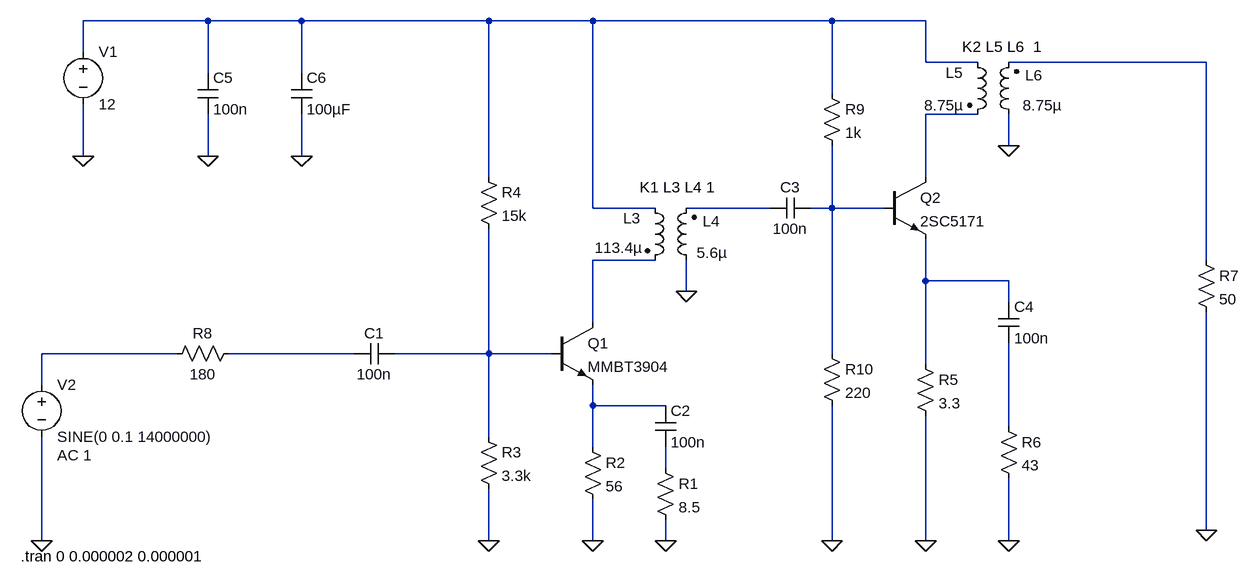
[diagram p0: schematic Driver Amplifier.asc]
Driver Amplifier.asc, the LTspice schematic file:
Version 4
SHEET 1 3796 680
WIRE -400 -352 -592 -352
WIRE -256 -352 -400 -352
WIRE 32 -352 -256 -352
WIRE 192 -352 32 -352
WIRE 560 -352 192 -352
WIRE 704 -352 560 -352
WIRE -592 -304 -592 -352
WIRE 704 -288 704 -352
WIRE 784 -288 704 -288
WIRE 1136 -288 832 -288
WIRE -400 -272 -400 -352
WIRE -256 -272 -256 -352
WIRE 560 -240 560 -352
WIRE 784 -208 704 -208
WIRE 832 -160 832 -208
WIRE -592 -144 -592 -224
WIRE -400 -144 -400 -208
WIRE -256 -144 -256 -208
WIRE 32 -112 32 -352
WIRE 704 -112 704 -208
WIRE 192 -64 192 -352
WIRE 288 -64 192 -64
WIRE 464 -64 336 -64
WIRE 560 -64 560 -160
WIRE 560 -64 528 -64
WIRE 640 -64 560 -64
WIRE 288 16 192 16
WIRE 1136 16 1136 -288
WIRE 704 48 704 -16
WIRE 832 48 704 48
WIRE 336 64 336 16
WIRE 832 80 832 48
WIRE 192 112 192 16
WIRE -448 160 -656 160
WIRE -176 160 -368 160
WIRE 32 160 32 -32
WIRE 32 160 -112 160
WIRE 128 160 32 160
WIRE 560 160 560 -64
WIRE 704 176 704 48
WIRE -656 208 -656 160
WIRE 192 240 192 208
WIRE 304 240 192 240
WIRE 832 272 832 144
WIRE 32 288 32 160
WIRE 192 304 192 240
WIRE 304 336 304 304
WIRE 1136 432 1136 96
WIRE -656 448 -656 288
WIRE 32 448 32 368
WIRE 192 448 192 384
WIRE 304 448 304 416
WIRE 560 448 560 240
WIRE 704 448 704 256
WIRE 832 448 832 352
FLAG -656 448 0
FLAG 304 448 0
FLAG 192 448 0
FLAG 32 448 0
FLAG 336 64 0
FLAG 832 -160 0
FLAG 704 448 0
FLAG 832 448 0
FLAG 1136 432 0
FLAG -592 -144 0
FLAG -400 -144 0
FLAG -256 -144 0
FLAG 560 448 0
SYMBOL npn 128 112 R0
SYMATTR InstName Q1
SYMATTR Value MMBT3904
SYMBOL npn 640 -112 R0
SYMATTR InstName Q2
SYMATTR Value 2SC5171
SYMBOL voltage -592 -320 R0
WINDOW 123 0 0 Left 2
WINDOW 39 0 0 Left 2
SYMATTR InstName V1
SYMATTR Value 12
SYMBOL voltage -656 192 R0
WINDOW 123 24 124 Left 2
WINDOW 39 0 0 Left 2
SYMATTR Value2 AC 1
SYMATTR InstName V2
SYMATTR Value SINE(0 0.1 14000000)
SYMBOL cap -112 144 R90
WINDOW 0 0 32 VBottom 2
WINDOW 3 32 32 VTop 2
SYMATTR InstName C1
SYMATTR Value 100n
SYMBOL cap 288 240 R0
SYMATTR InstName C2
SYMATTR Value 100n
SYMBOL res 288 320 R0
SYMATTR InstName R1
SYMATTR Value 8.5
SYMBOL res 176 288 R0
SYMATTR InstName R2
SYMATTR Value 56
SYMBOL res 16 272 R0
SYMATTR InstName R3
SYMATTR Value 3.3k
SYMBOL res 16 -128 R0
SYMATTR InstName R4
SYMATTR Value 15k
SYMBOL ind2 272 -80 R0
WINDOW 0 -33 32 Left 2
WINDOW 3 -77 77 Left 2
SYMATTR InstName L3
SYMATTR Value 113.4µ
SYMATTR Type ind
SYMBOL ind2 352 32 R180
WINDOW 0 -36 76 Left 2
WINDOW 3 -47 27 Left 2
SYMATTR InstName L4
SYMATTR Value 5.6µ
SYMATTR Type ind
SYMBOL cap 528 -80 R90
WINDOW 0 0 32 VBottom 2
WINDOW 3 32 32 VTop 2
SYMATTR InstName C3
SYMATTR Value 100n
SYMBOL res 688 160 R0
SYMATTR InstName R5
SYMATTR Value 3.3
SYMBOL res 816 256 R0
SYMATTR InstName R6
SYMATTR Value 43
SYMBOL cap 816 80 R0
SYMATTR InstName C4
SYMATTR Value 100n
SYMBOL ind2 768 -304 R0
WINDOW 0 -33 32 Left 2
WINDOW 3 -66 82 Left 2
SYMATTR InstName L5
SYMATTR Value 8.75µ
SYMATTR Type ind
SYMBOL ind2 848 -192 R180
WINDOW 0 -36 76 Left 2
WINDOW 3 -66 30 Left 2
SYMATTR InstName L6
SYMATTR Value 8.75µ
SYMATTR Type ind
SYMBOL res 1120 0 R0
SYMATTR InstName R7
SYMATTR Value 50
SYMBOL cap -416 -272 R0
SYMATTR InstName C5
SYMATTR Value 100n
SYMBOL cap -272 -272 R0
SYMATTR InstName C6
SYMATTR Value 100µF
SYMBOL res -352 144 R90
WINDOW 0 0 56 VBottom 2
WINDOW 3 32 56 VTop 2
SYMATTR InstName R8
SYMATTR Value 180
SYMBOL res 544 -256 R0
SYMATTR InstName R9
SYMATTR Value 1k
SYMBOL res 544 144 R0
SYMATTR InstName R10
SYMATTR Value 220
TEXT 264 -96 Left 2 !K1 L3 L4 1
TEXT 760 -312 Left 2 !K2 L5 L6  1
TEXT -688 472 Left 2 !.tran 0 0.000002 0.000001

The netlist it stands for:
* Driver Amplifier.asc
Q1 N006 N010 N011 0 MMBT3904
Q2 N003 N005 N007 0 2SC5171
V1 N001 0 12
V2 N008 0 SINE(0 0.1 14000000) AC 1
C1 N010 N009 100n
C2 N011 N013 100n
R1 N013 0 8.5
R2 N011 0 56
R3 N010 0 3.3k
R4 N001 N010 15k
L3 N001 N006 113.4µ
L4 0 N004 5.6µ
C3 N005 N004 100n
R5 N007 0 3.3
R6 N012 0 43
C4 N007 N012 100n
L5 N001 N003 8.75µ
L6 0 N002 8.75µ
R7 N002 0 50
C5 N001 0 100n
C6 N001 0 100µF
R8 N009 N008 180
R9 N001 N005 1k
R10 N005 0 220
.model NPN NPN
.model PNP PNP
.lib standard.bjt
K1 L3 L4 1
K2 L5 L6  1
.tran 0 0.000002 0.000001
.backanno
.end